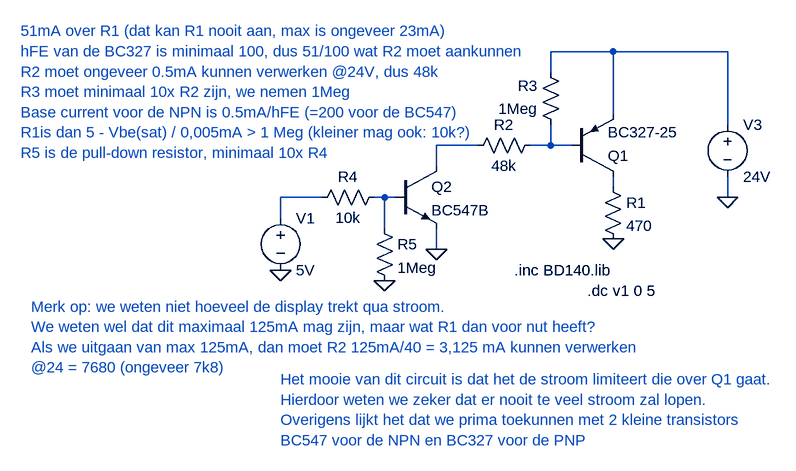
[diagram p0: schematic PNP-switching.asc]
PNP-switching.asc, the LTspice schematic file:
Version 4
SHEET 1 2852 680
WIRE 912 -48 816 -48
WIRE 1088 -48 912 -48
WIRE 816 -16 816 -48
WIRE 912 48 912 -48
WIRE 1088 64 1088 -48
WIRE 704 96 640 96
WIRE 816 96 816 64
WIRE 816 96 784 96
WIRE 848 96 816 96
WIRE 640 128 640 96
WIRE 912 160 912 144
WIRE 464 176 400 176
WIRE 560 176 544 176
WIRE 576 176 560 176
WIRE 1088 176 1088 144
WIRE 400 208 400 176
WIRE 560 224 560 176
WIRE 640 256 640 224
FLAG 912 240 0
FLAG 1088 176 0
FLAG 640 256 0
FLAG 400 288 0
FLAG 560 304 0
SYMBOL Voltage 400 192 R0
SYMATTR InstName V1
SYMATTR Value 5V
SYMBOL Voltage 1088 48 R0
SYMATTR InstName V3
SYMATTR Value 24V
SYMBOL pnp 848 144 M180
SYMATTR InstName Q1
SYMATTR Value BC327-25
SYMBOL Res 896 144 R0
SYMATTR InstName R1
SYMATTR Value 470
SYMBOL Res 800 80 R90
WINDOW 0 0 56 VBottom 2
WINDOW 3 32 56 VTop 2
SYMATTR InstName R2
SYMATTR Value 48k
SYMBOL Res 832 80 R180
WINDOW 0 36 76 Left 2
WINDOW 3 36 40 Left 2
SYMATTR InstName R3
SYMATTR Value 1Meg
SYMBOL npn 576 128 R0
SYMATTR InstName Q2
SYMATTR Value BC547B
SYMBOL Res 560 160 R90
WINDOW 0 0 56 VBottom 2
WINDOW 3 32 56 VTop 2
SYMATTR InstName R4
SYMATTR Value 10k
SYMBOL Res 544 208 R0
SYMATTR InstName R5
SYMATTR Value 1Meg
TEXT 760 288 Left 2 !.inc BD140.lib
TEXT 872 320 Left 2 !.dc v1 0 5
TEXT 0 -80 Left 2 ;51mA over R1 (dat kan R1 nooit aan, max is ongeveer 23mA)\nhFE van de BC327 is minimaal 100, dus 51/100 wat R2 moet aankunnen\nR2 moet ongeveer 0.5mA kunnen verwerken @24V, dus 48k\nR3 moet minimaal 10x R2 zijn, we nemen 1Meg\nBase current voor de NPN is 0.5mA/hFE (=200 voor de BC547)\nR1is dan 5 - Vbe(sat) / 0,005mA > 1 Meg (kleiner mag ook: 10k?)\nR5 is de pull-down resistor, minimaal 10x R4
TEXT 16 344 Left 2 ;Merk op: we weten niet hoeveel de display trekt qua stroom.\nWe weten wel dat dit maximaal 125mA mag zijn, maar wat R1 dan voor nut heeft?\nAls we uitgaan van max 125mA, dan moet R2 125mA/40 = 3,125 mA kunnen verwerken\n@24 = 7680 (ongeveer 7k8)
TEXT 400 456 Left 2 ;Het mooie van dit circuit is dat het de stroom limiteert die over Q1 gaat.\nHierdoor weten we zeker dat er nooit te veel stroom zal lopen.\nOverigens lijkt het dat we prima toekunnen met 2 kleine transistors\nBC547 voor de NPN en BC327 voor de PNP

The netlist it stands for:
* PNP-switching.asc
V1 N005 0 5V
V3 N001 0 24V
Q1 N004 N003 N001 0 BC327-25
R1 N004 0 470
R2 N003 N002 48k
R3 N003 N001 1Meg
Q2 N002 N006 0 0 BC547B
R4 N006 N005 10k
R5 N006 0 1Meg
.model NPN NPN
.model PNP PNP
.lib standard.bjt
.inc BD140.lib
.dc v1 0 5
* 51mA over R1 (dat kan R1 nooit aan, max is ongeveer 23mA)
* hFE van de BC327 is minimaal 100, dus 51/100 wat R2 moet aankunnen
* R2 moet ongeveer 0.5mA kunnen verwerken @24V, dus 48k
* R3 moet minimaal 10x R2 zijn, we nemen 1Meg
* Base current voor de NPN is 0.5mA/hFE (=200 voor de BC547)
* R1is dan 5 - Vbe(sat) / 0,005mA > 1 Meg (kleiner mag ook: 10k?)
* R5 is de pull-down resistor, minimaal 10x R4
* Merk op: we weten niet hoeveel de display trekt qua stroom.
* We weten wel dat dit maximaal 125mA mag zijn, maar wat R1 dan voor nut heeft?
* Als we uitgaan van max 125mA, dan moet R2 125mA/40 = 3,125 mA kunnen verwerken
* @24 = 7680 (ongeveer 7k8)
* Het mooie van dit circuit is dat het de stroom limiteert die over Q1 gaat.
* Hierdoor weten we zeker dat er nooit te veel stroom zal lopen.
* Overigens lijkt het dat we prima toekunnen met 2 kleine transistors
* BC547 voor de NPN en BC327 voor de PNP
.backanno
.end